# Altium schematic sheet all.SchDoc
size A3
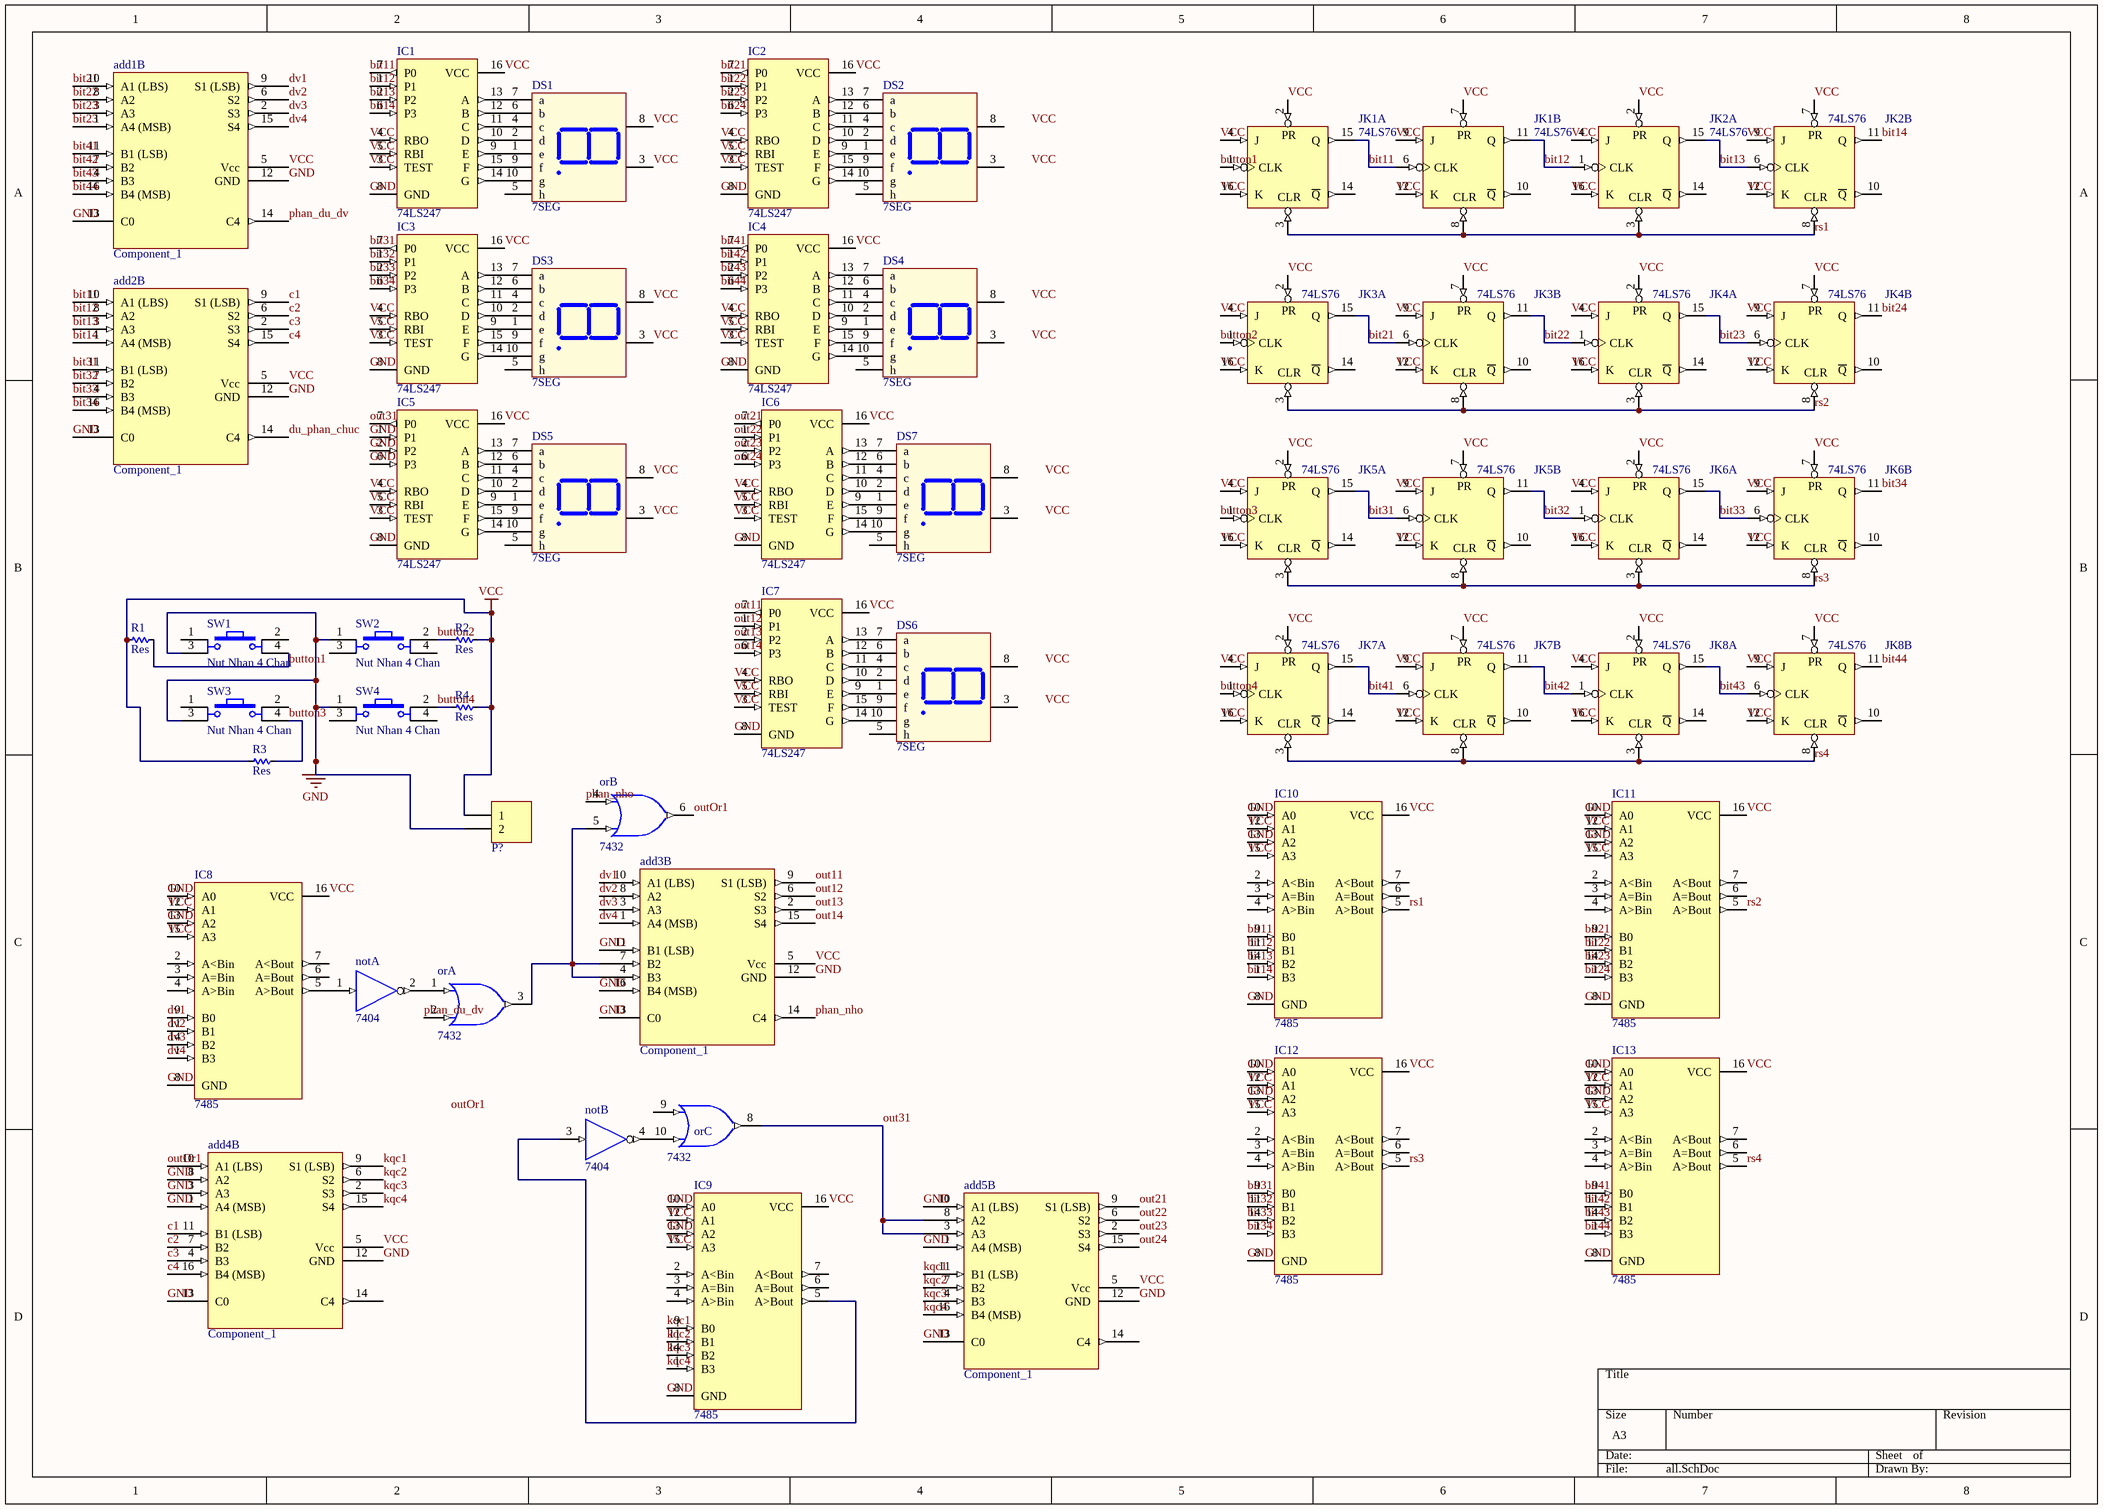
[diagram p0: all.SchDoc]

## Parts
add1  Component_1  [DIP16/W0.3]  (part B of 2)
add2  Component_1  [DIP16/W0.3]  (part B of 2)
add3  Component_1  [DIP16/W0.3]  (part B of 2)
add4  Component_1  [DIP16/W0.3]  (part B of 2)
add5  Component_1  [DIP16/W0.3]  (part B of 2)
DS1  7SEG  [LED7SEG-1-0.56]
DS2  7SEG  [LED7SEG-1-0.56]
DS3  7SEG  [LED7SEG-1-0.56]
DS4  7SEG  [LED7SEG-1-0.56]
DS5  7SEG  [LED7SEG-1-0.56]
DS6  7SEG  [LED7SEG-1-0.56]
DS7  7SEG  [LED7SEG-1-0.56]
IC1  74LS247  [DIP16]
IC2  74LS247  [DIP16]
IC3  74LS247  [DIP16]
IC4  74LS247  [DIP16]
IC5  74LS247  [DIP16]
IC6  74LS247  [DIP16]
IC7  74LS247  [DIP16]
IC8  7485  [DIP16/W0.3]
IC9  7485  [DIP16/W0.3]
IC10  7485  [DIP16/W0.3]
IC11  7485  [DIP16/W0.3]
IC12  7485  [DIP16/W0.3]
IC13  7485  [DIP16/W0.3]
JK1  74LS76  [DIP16/W0.3]  (parts A,B of 2)
JK2  74LS76  [DIP16/W0.3]  (parts A,B of 2)
JK3  74LS76  [DIP16/W0.3]  (parts A,B of 2)
JK4  74LS76  [DIP16/W0.3]  (parts A,B of 2)
JK5  74LS76  [DIP16/W0.3]  (parts A,B of 2)
JK6  74LS76  [DIP16/W0.3]  (parts A,B of 2)
JK7  74LS76  [DIP16/W0.3]  (parts A,B of 2)
JK8  74LS76  [DIP16/W0.3]  (parts A,B of 2)
not  7404  [DIP14_SOCKET]  (parts A,B of 6)
or  7432  [DIP14]  (parts A,B,C of 4)
P?  Domino 2  [DOMINO 2- 5mm]  (value not drawn)
R1  Res  [RES-1/2W]
R2  Res  [RES-1/2W]
R3  Res  [RES-1/2W]
R4  Res  [RES-1/2W]
SW1  Nut Nhan 4 Chan  [SW-4P-S]
SW2  Nut Nhan 4 Chan  [SW-4P-S]
SW3  Nut Nhan 4 Chan  [SW-4P-S]
SW4  Nut Nhan 4 Chan  [SW-4P-S]

## Nets
GND: add1.12(GND) add1.13(C0) add2.12(GND) add2.13(C0) add3.11(B1_(LSB)) add3.12(GND) add3.13(C0) add3.16(B4_(MSB)) add4.1(A4_(MSB)) add4.3(A3) add4.8(A2) add4.12(GND) add4.13(C0) add5.1(A4_(MSB)) add5.10(A1_(LBS)) add5.12(GND) add5.13(C0) IC1.8(GND) IC2.8(GND) IC3.8(GND) IC4.8(GND) IC5.1(P1) IC5.2(P2) IC5.6(P3) IC5.8(GND) IC6.8(GND) IC7.8(GND) IC8.8(GND) IC8.10(A0) IC8.13(A2) IC9.8(GND) IC9.10(A0) IC9.13(A2) IC10.8(GND) IC10.10(A0) IC10.13(A2) IC11.8(GND) IC11.10(A0) IC11.13(A2) IC12.8(GND) IC12.10(A0) IC12.13(A2) IC13.8(GND) IC13.10(A0) IC13.13(A2) JK1.13(GND) JK2.13(GND) JK3.13(GND) JK4.13(GND) JK5.13(GND) JK6.13(GND) JK7.13(GND) JK8.13(GND) not.7(GND) or.7(GND) P?.2 SW1.3 SW2.1 SW3.3 SW4.1
VCC: add1.5(Vcc) add2.5(Vcc) add3.5(Vcc) add4.5(Vcc) add5.5(Vcc) DS1.3(Vcc) DS1.8(Vcc) DS3.3(Vcc) DS3.8(Vcc) DS5.3(Vcc) DS5.8(Vcc) IC1.3(TEST) IC1.4(RBO) IC1.5(RBI) IC1.16(VCC) IC2.3(TEST) IC2.4(RBO) IC2.5(RBI) IC2.16(VCC) IC3.3(TEST) IC3.4(RBO) IC3.5(RBI) IC3.16(VCC) IC4.3(TEST) IC4.4(RBO) IC4.5(RBI) IC4.16(VCC) IC5.3(TEST) IC5.4(RBO) IC5.5(RBI) IC5.16(VCC) IC6.3(TEST) IC6.4(RBO) IC6.5(RBI) IC6.16(VCC) IC7.3(TEST) IC7.4(RBO) IC7.5(RBI) IC7.16(VCC) IC8.12(A1) IC8.15(A3) IC8.16(VCC) IC9.12(A1) IC9.15(A3) IC9.16(VCC) IC10.12(A1) IC10.15(A3) IC10.16(VCC) IC11.12(A1) IC11.15(A3) IC11.16(VCC) IC12.12(A1) IC12.15(A3) IC12.16(VCC) IC13.12(A1) IC13.15(A3) IC13.16(VCC) JK1.2(PR) JK1.4(J) JK1.5(VCC) JK1.7(PR) JK1.9(J) JK1.12(K) JK1.16(K) JK2.2(PR) JK2.4(J) JK2.5(VCC) JK2.7(PR) JK2.9(J) JK2.12(K) JK2.16(K) JK3.2(PR) JK3.4(J) JK3.5(VCC) JK3.7(PR) JK3.9(J) JK3.12(K) JK3.16(K) JK4.2(PR) JK4.4(J) JK4.5(VCC) JK4.7(PR) JK4.9(J) JK4.12(K) JK4.16(K) JK5.2(PR) JK5.4(J) JK5.5(VCC) JK5.7(PR) JK5.9(J) JK5.12(K) JK5.16(K) JK6.2(PR) JK6.4(J) JK6.5(VCC) JK6.7(PR) JK6.9(J) JK6.12(K) JK6.16(K) JK7.2(PR) JK7.4(J) JK7.5(VCC) JK7.7(PR) JK7.9(J) JK7.12(K) JK7.16(K) JK8.2(PR) JK8.4(J) JK8.5(VCC) JK8.7(PR) JK8.9(J) JK8.12(K) JK8.16(K) not.14(VCC) or.14(VCC) P?.1 R1.2 R2.1 R3.2 R4.1
bit11: add2.10(A1_(LBS)) IC1.7(P0) IC10.9(B0) JK1.6(CLK) JK1.15(Q)
bit12: add2.8(A2) IC1.1(P1) IC10.11(B1) JK1.11(Q) JK2.1(CLK)
bit13: add2.3(A3) IC1.2(P2) IC10.14(B2) JK2.6(CLK) JK2.15(Q)
bit14: add2.1(A4_(MSB)) IC1.6(P3) IC10.1(B3) JK2.11(Q)
bit21: add1.10(A1_(LBS)) IC2.7(P0) IC11.9(B0) JK3.6(CLK) JK3.15(Q)
bit22: add1.8(A2) IC2.1(P1) IC11.11(B1) JK3.11(Q) JK4.1(CLK)
bit23: add1.1(A4_(MSB)) add1.3(A3) IC2.2(P2) IC11.14(B2) JK4.6(CLK) JK4.15(Q)
bit24: IC2.6(P3) IC11.1(B3) JK4.11(Q)
bit31: add2.11(B1_(LSB)) IC3.7(P0) IC12.9(B0) JK5.6(CLK) JK5.15(Q)
bit32: add2.7(B2) IC3.1(P1) IC12.11(B1) JK5.11(Q) JK6.1(CLK)
bit33: add2.4(B3) IC3.2(P2) IC12.14(B2) JK6.6(CLK) JK6.15(Q)
bit34: add2.16(B4_(MSB)) IC3.6(P3) IC12.1(B3) JK6.11(Q)
bit41: add1.11(B1_(LSB)) IC4.7(P0) IC13.9(B0) JK7.6(CLK) JK7.15(Q)
bit42: add1.7(B2) IC4.1(P1) IC13.11(B1) JK7.11(Q) JK8.1(CLK)
bit43: add1.4(B3) IC4.2(P2) IC13.14(B2) JK8.6(CLK) JK8.15(Q)
bit44: add1.16(B4_(MSB)) IC4.6(P3) IC13.1(B3) JK8.11(Q)
button1: JK1.1(CLK) R1.1 SW1.4
button2: JK3.1(CLK) R2.2 SW2.2
button3: JK5.1(CLK) R3.1 SW3.4
button4: JK7.1(CLK) R4.2 SW4.2
c1: add2.9(S1_(LSB)) add4.11(B1_(LSB))
c2: add2.6(S2) add4.7(B2)
c3: add2.2(S3) add4.4(B3)
c4: add2.15(S4) add4.16(B4_(MSB))
du_phan_chuc: add2.14(C4)
dv1: add1.9(S1_(LSB)) add3.10(A1_(LBS)) IC8.9(B0)
dv2: add1.6(S2) add3.8(A2) IC8.11(B1)
dv3: add1.2(S3) add3.3(A3) IC8.14(B2)
dv4: add1.15(S4) add3.1(A4_(MSB)) IC8.1(B3)
kqc1: add4.9(S1_(LSB)) add5.11(B1_(LSB)) IC9.9(B0)
kqc2: add4.6(S2) add5.7(B2) IC9.11(B1)
kqc3: add4.2(S3) add5.4(B3) IC9.14(B2)
kqc4: add4.15(S4) add5.16(B4_(MSB)) IC9.1(B3)
out11: add3.9(S1_(LSB)) IC7.7(P0)
out12: add3.6(S2) IC7.1(P1)
out13: add3.2(S3) IC7.2(P2)
out14: add3.15(S4) IC7.6(P3)
out21: add5.9(S1_(LSB)) IC6.7(P0)
out22: add5.6(S2) IC6.1(P1)
out23: add5.2(S3) IC6.2(P2)
out24: add5.15(S4) IC6.6(P3)
out31: add5.3(A3) add5.8(A2) IC5.7(P0) or.8(Y)
outOr1: add4.10(A1_(LBS)) or.6(Y)
phan_du_dv: add1.14(C4) or.2(B)
phan_nho: add3.14(C4) or.4(A)
rs1: IC10.5(A>Bout) JK1.3(CLR) JK1.8(CLR) JK2.3(CLR) JK2.8(CLR)
rs2: IC11.5(A>Bout) JK3.3(CLR) JK3.8(CLR) JK4.3(CLR) JK4.8(CLR)
rs3: IC12.5(A>Bout) JK5.3(CLR) JK5.8(CLR) JK6.3(CLR) JK6.8(CLR)
rs4: IC13.5(A>Bout) JK7.3(CLR) JK7.8(CLR) JK8.3(CLR) JK8.8(CLR)
Netadd3_4: add3.4(B3) add3.7(B2) or.3(Y) or.5(B)
NetDS1_1: DS1.1(e) IC1.9(E)
NetDS1_2: DS1.2(d) IC1.10(D)
NetDS1_4: DS1.4(c) IC1.11(C)
NetDS1_6: DS1.6(b) IC1.12(B)
NetDS1_7: DS1.7(a) IC1.13(A)
NetDS1_9: DS1.9(f) IC1.15(F)
NetDS1_10: DS1.10(g) IC1.14(G)
NetDS2_1: DS2.1(e) IC2.9(E)
NetDS2_2: DS2.2(d) IC2.10(D)
NetDS2_4: DS2.4(c) IC2.11(C)
NetDS2_6: DS2.6(b) IC2.12(B)
NetDS2_7: DS2.7(a) IC2.13(A)
NetDS2_9: DS2.9(f) IC2.15(F)
NetDS2_10: DS2.10(g) IC2.14(G)
NetDS3_1: DS3.1(e) IC3.9(E)
NetDS3_2: DS3.2(d) IC3.10(D)
NetDS3_4: DS3.4(c) IC3.11(C)
NetDS3_6: DS3.6(b) IC3.12(B)
NetDS3_7: DS3.7(a) IC3.13(A)
NetDS3_9: DS3.9(f) IC3.15(F)
NetDS3_10: DS3.10(g) IC3.14(G)
NetDS4_1: DS4.1(e) IC4.9(E)
NetDS4_2: DS4.2(d) IC4.10(D)
NetDS4_4: DS4.4(c) IC4.11(C)
NetDS4_6: DS4.6(b) IC4.12(B)
NetDS4_7: DS4.7(a) IC4.13(A)
NetDS4_9: DS4.9(f) IC4.15(F)
NetDS4_10: DS4.10(g) IC4.14(G)
NetDS5_1: DS5.1(e) IC5.9(E)
NetDS5_2: DS5.2(d) IC5.10(D)
NetDS5_4: DS5.4(c) IC5.11(C)
NetDS5_6: DS5.6(b) IC5.12(B)
NetDS5_7: DS5.7(a) IC5.13(A)
NetDS5_9: DS5.9(f) IC5.15(F)
NetDS5_10: DS5.10(g) IC5.14(G)
NetDS6_1: DS6.1(e) IC7.9(E)
NetDS6_2: DS6.2(d) IC7.10(D)
NetDS6_4: DS6.4(c) IC7.11(C)
NetDS6_6: DS6.6(b) IC7.12(B)
NetDS6_7: DS6.7(a) IC7.13(A)
NetDS6_9: DS6.9(f) IC7.15(F)
NetDS6_10: DS6.10(g) IC7.14(G)
NetDS7_1: DS7.1(e) IC6.9(E)
NetDS7_2: DS7.2(d) IC6.10(D)
NetDS7_4: DS7.4(c) IC6.11(C)
NetDS7_6: DS7.6(b) IC6.12(B)
NetDS7_7: DS7.7(a) IC6.13(A)
NetDS7_9: DS7.9(f) IC6.15(F)
NetDS7_10: DS7.10(g) IC6.14(G)
NetIC8_5: IC8.5(A>Bout) not.1(A)
NetIC9_5: IC9.5(A>Bout) not.3(A)
Netnot_2: not.2(~{O}) or.1(A)
Netnot_4: not.4(~{O}) or.10(B)

Not connected (* = marked no-connect by the designer): add4 14(C4); add5 14(C4); DS1 5(h); DS2 3(Vcc) 5(h) 8(Vcc); DS3 5(h); DS4 3(Vcc) 5(h) 8(Vcc); DS5 5(h); DS6 3(Vcc) 5(h) 8(Vcc); DS7 3(Vcc) 5(h) 8(Vcc); IC8 2(A<Bin) 3(A=Bin) 4(A>Bin) 6(A=Bout) 7(A<Bout); IC9 2(A<Bin) 3(A=Bin) 4(A>Bin) 6(A=Bout) 7(A<Bout); IC10 2(A<Bin) 3(A=Bin) 4(A>Bin) 6(A=Bout) 7(A<Bout); IC11 2(A<Bin) 3(A=Bin) 4(A>Bin) 6(A=Bout) 7(A<Bout); IC12 2(A<Bin) 3(A=Bin) 4(A>Bin) 6(A=Bout) 7(A<Bout); IC13 2(A<Bin) 3(A=Bin) 4(A>Bin) 6(A=Bout) 7(A<Bout); JK1 10(~{Q}) 14(~{Q}); JK2 10(~{Q}) 14(~{Q}); JK3 10(~{Q}) 14(~{Q}); JK4 10(~{Q}) 14(~{Q}); JK5 10(~{Q}) 14(~{Q}); JK6 10(~{Q}) 14(~{Q}); JK7 10(~{Q}) 14(~{Q}); JK8 10(~{Q}) 14(~{Q}); or 9(A); SW1 1 2; SW2 3 4; SW3 1 2; SW4 3 4

## Notes on the sheet
- Labels drawn without touching a wire or pin: outOr1, VCC

## Library data of the parts
DS1-DS7 = LED7SEG-1: 14.2 mm General Purpose Blue 7-Segment Display: CC, RH DP, Gray Surface; MinimumIntensity: 2020 ucd; Note: IF = 10 mA; Published: 8-Jun-2000; LatestRevisionDate: 17-Dec-2003; LatestRevisionNote: Schematic revised, PCB Footprint replaced.; DatasheetDocument: 24-Sep-2002; PackageDocument: 24-Sep-2002; PackageReference: H; Publisher: Altium Limited; Colour: Blue; ComponentLink1Description: Manufacturer Link; ComponentLink1URL: http://www.agilent.com/
IC1-IC7 = 74247: Value: 74LS238; Copyright by: VanDungEvn@Gmail.com
IC8-IC13 = 7485: 4-Bit Magnitude Comparator; Copyright by: VanDungEvn@Gmail.com; Value: 7485
JK1-JK8 = 7476: Dual J-K Flip-Flop; Copyright by: VanDungEvn@Gmail.com; Value: 74LS76
not = 7404: Hex Inverter; Code_IPC: SOIC127P600-14; ComponentLink1Description: Manufacturer Link; ComponentLink1URL: http://www.national.com/; ComponentLink2Description: Datasheet; ComponentLink2URL: http://www.fairchildsemi.com/ds/74/74F04.pdf; Value: 7404
or = 7432: Quad 2-Input OR Gate
P? = Domino 2: Domino, 2-Pin; LatestRevisionDate: 17-Jul-2002; LatestRevisionNote: Re-released for DXP Platform.; Publisher: Altium Limited
R1-R4 = Res: Manufacturer: Generic Components; Class: Passive; SubClass: R; Published: 08/06/2000; Publisher: Altium Hobart Technology Centre
SW1-SW4 = Nut Nhan 4 Chan: Cắm; Value: Nút Nhấn 4 Chân 6x6x9MM DIP; Ma_Hang: MH004077; Don_Vi: Con; Kieu Chan: *; Ghi Chu: *